# Altium schematic sheet vista_frontal_con_disparo.SchDoc
size A
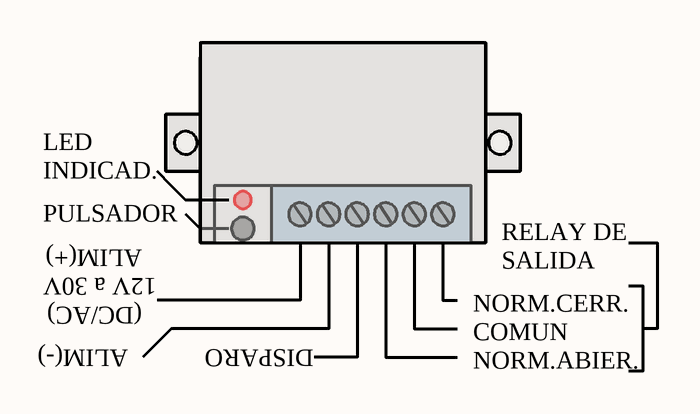
[diagram p0: vista_frontal_con_disparo.SchDoc]

## Notes on the sheet
- INDICAD.
- PULSADOR
- LED
- ALIM(+)
- 12V a 30V
- ALIM(-)
- (DC/AC)
- DISPARO
- NORM.CERR.
  COMUN
  NORM.ABIER.
- RELAY DE SALIDA